# EAGLE design Schaltplan_Ampel (EAGLE 9.6.2)
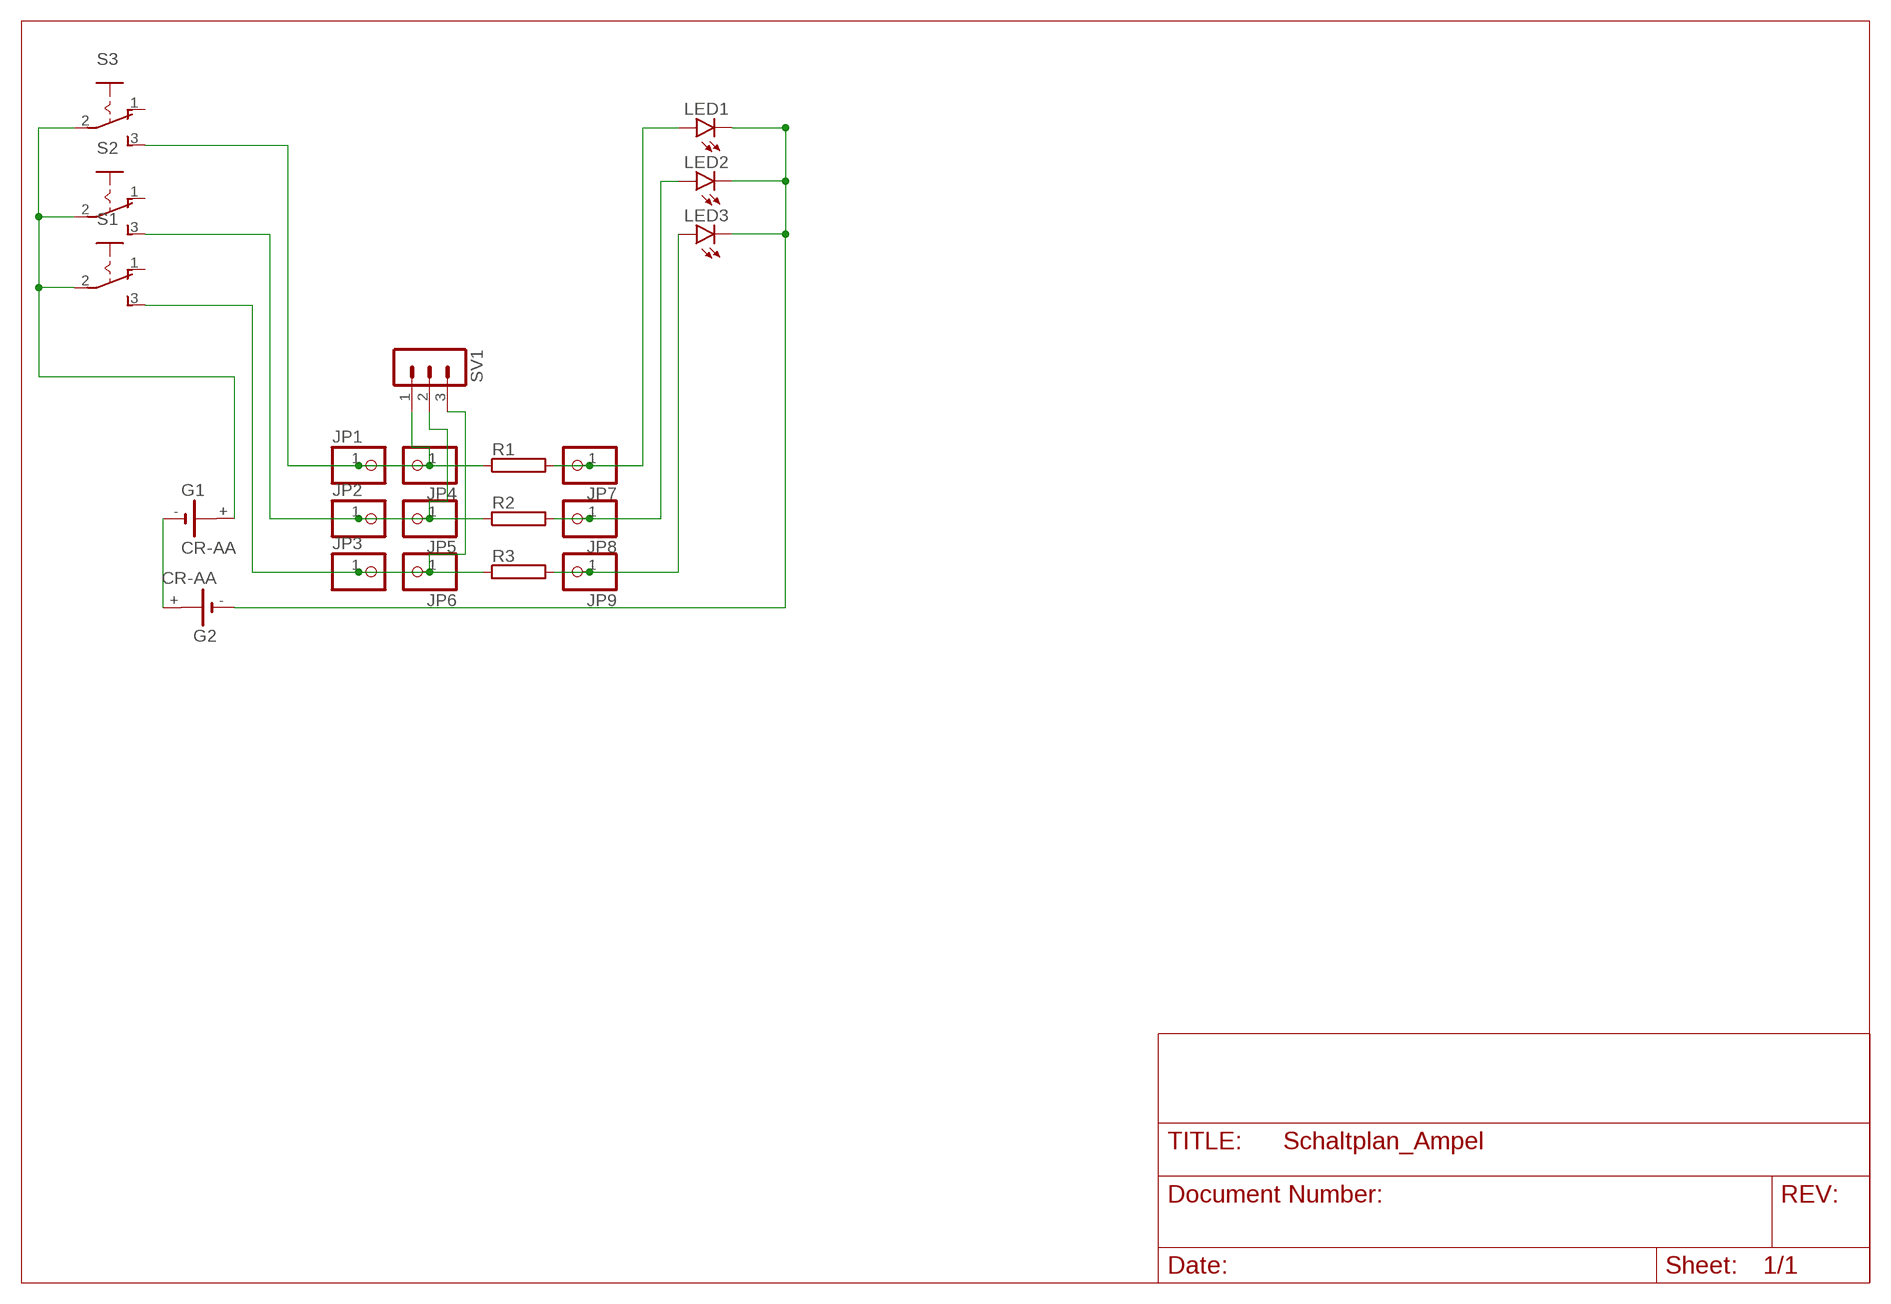
[diagram p0: schematic, sheet 1]

## Parts
G1  CR-AA  [CRAA]
G2  CR-AA  [CRAA]
JP1  PINHD-1X1  [1X01]
JP2  PINHD-1X1  [1X01]
JP3  PINHD-1X1  [1X01]
JP4  PINHD-1X1  [1X01]
JP5  PINHD-1X1  [1X01]
JP6  PINHD-1X1  [1X01]
JP7  PINHD-1X1  [1X01]
JP8  PINHD-1X1  [1X01]
JP9  PINHD-1X1  [1X01]
LED1  LED3MM  [LED3MM]
LED2  LED3MM  [LED3MM]
LED3  LED3MM  [LED3MM]
R1  RCA0002  [CA0002]
R2  RCA0002  [CA0002]
R3  RCA0002  [CA0002]
S1  255SB  [255SB]
S2  255SB  [255SB]
S3  255SB  [255SB]
SV1  MA03-1  [MA03-1]

## Nets
N$1: G1.- G2.+
N$2: G1.+ S1.2(P) S2.2(P) S3.2(P)
N$3: G2.- LED1.K(C) LED2.K(C) LED3.K(C)
N$4: JP3.1 JP6.1 R3.1 S1.3(S) SV1.3
N$5: JP2.1 JP5.1 R2.1 S2.3(S) SV1.2
N$6: JP1.1 JP4.1 R1.1 S3.3(S) SV1.1
N$7: JP7.1 LED1.A R1.2
N$8: JP8.1 LED2.A R2.2
N$9: JP9.1 LED3.A R3.2
Unconnected: G1.+@1(+) G2.+@1(+) S1.1(O) S2.1(O) S3.1(O)

## Library data of the parts
G1 G2 = battery:CR-AA: LI BATTERY Varta CRAA-SLF
JP1-JP9 = pinhead:PINHD-1X1: PIN HEADER
LED1-LED3 = led:LED: LED OSRAM: - CHIPLED LG R971, LG N971, LY N971, LG Q971, LY Q971, LO R971, LY R971 LH N974, LH R974 LS Q976, LO Q976, LY Q976 LO Q996 - Hyper CHIPLED LW Q18S LB Q993, LB Q99A, LB R99A - SideLED LS A670, LO A670, LY A670, LG A670, LP A670 LB A673, LV A673, LT A673, LW A673 LH A674 LY A675 LS A676, LA A676, LO A676, LY A676, LW A676 LS A679, LY A679, LG A679 - Hyper Micro SIDELED® LS Y876, LA Y876, LO Y876, LY Y876 LT Y87S - SmartLED LW L88C, LW L88S LB L89C, LB L89S, LG L890 LS L89K, LO L89K, LY L89K LS L896, LA L896, LO L896, LY L896 - TOPLED LS T670, LO T670, LY T670, LG T670, LP T670 LSG T670, LSP T670, LSY T670, LOP T670, LYG T670 LG T671, LOG T671, LSG T671 LB T673, LV T673, LT T673, LW T673 LH T674 LS T676, LA T676, LO T676, LY T676, LB T676, LH T676, LSB T676, LW T676 LB T67C, LV T67C, LT T67C, LS T67K, LO T67K, LY T67K, LW E67C LS E67B, LA E67B, LO E67B, LY E67B, LB E67C, LV E67C, LT E67C LW T67C LS T679, LY T679, LG T679 LS T770, LO T770, LY T770, LG T770, LP T770 LB T773, LV T773, LT T773, LW T773 LH T774 LS E675, LA E675, LY E675, LS T675 LS T776, LA T776, LO T776, LY T776, LB T776 LHGB T686 LT T68C, LB T68C - Hyper Mini TOPLED® LB M676 - Mini TOPLED Santana® LG M470 LS M47K, LO M47K, LY M47K Source: http://www.osram.convergy.de LUXEON: - LUMILED® LXK2-PW12-R00, LXK2-PW12-S00, LXK2-PW14-U00, LXK2-PW14-V00 LXK2-PM12-R00, LXK2-PM12-S00, LXK2-PM14-U00 LXK2-PE12-Q00, LXK2-PE12-R00, LXK2-PE12-S00, LXK2-PE14-T00, LXK2-PE14-U00 LXK2-PB12-K00, LXK2-PB12-L00, LXK2-PB12-M00, LXK2-PB14-N00, LXK2-PB14-P00, LXK2-PB14-Q00 LXK2-PR12-L00, LXK2-PR12-M00, LXK2-PR14-Q00, LXK2-PR14-R00 LXK2-PD12-Q00, LXK2-PD12-R00, LXK2-PD12-S00 LXK2-PH12-R00, LXK2-PH12-S00 LXK2-PL12-P00, LXK2-PL12-Q00, LXK2-PL12-R00 Source: www.luxeon.com KINGBRIGHT: KA-3528ASYC Source: www.kingbright.com
R1-R3 = resistor-power:R: Power Resitor; OC_FARNELL: unknown; OC_NEWARK: unknown
S1-S3 = switch:255SB: SLIDING SWITCH Distributor Buerklin, 11G810
SV1 = con-lstb:MA03-1: PIN HEADER; OC_FARNELL: unknown; OC_NEWARK: unknown

## Board
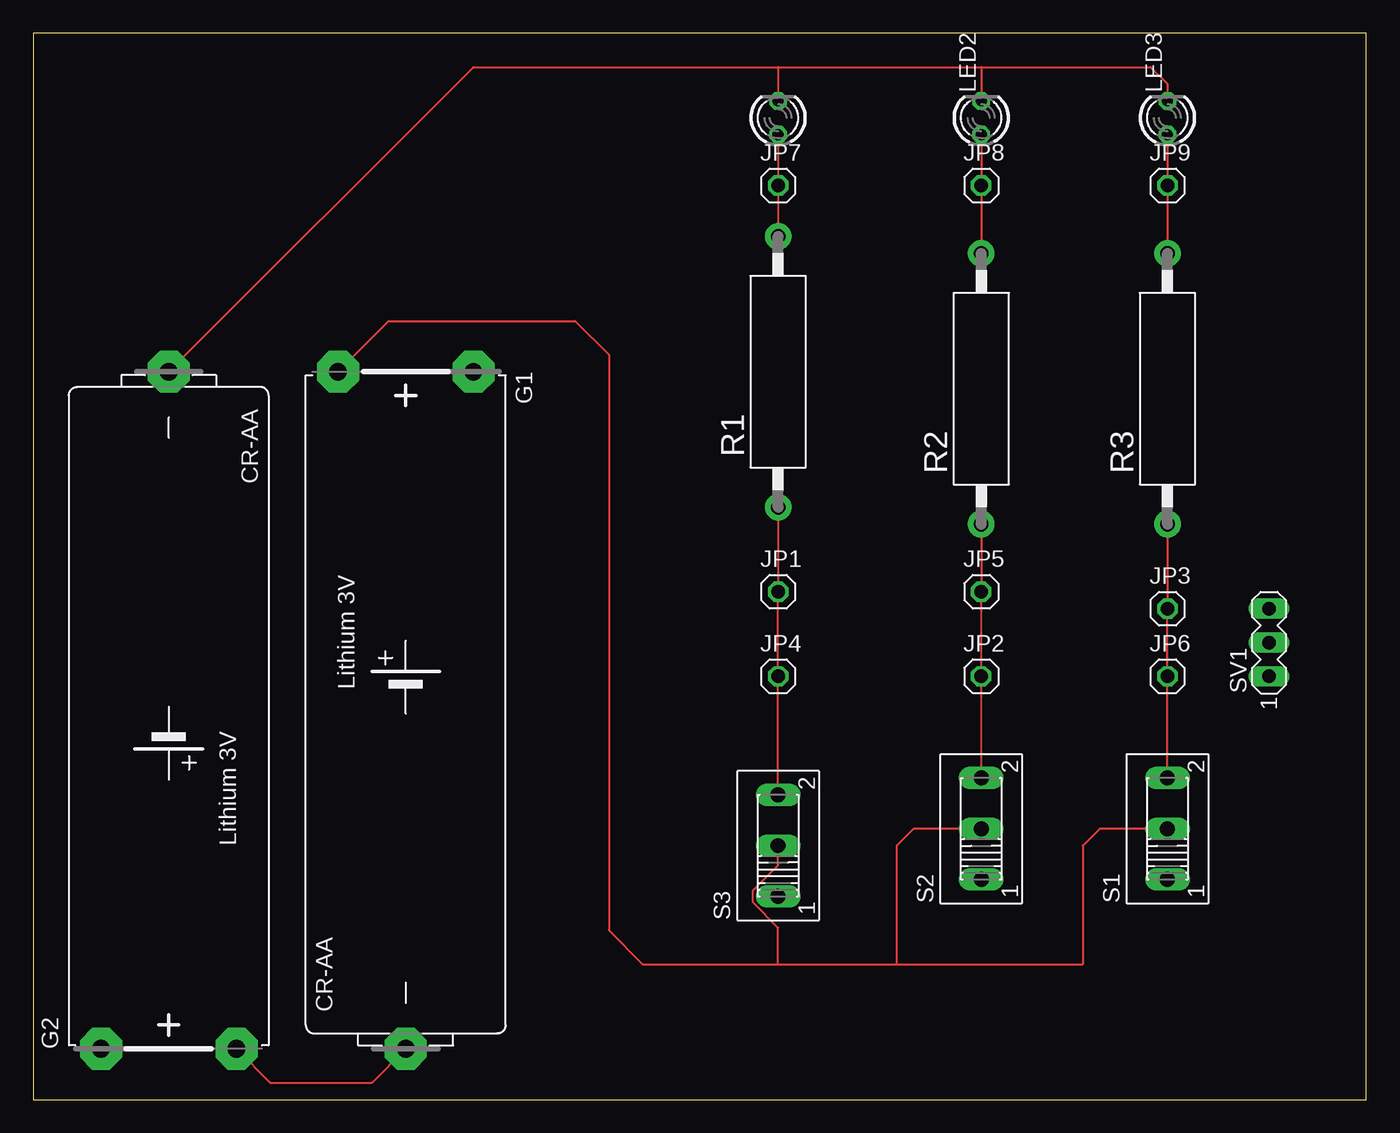
[diagram p1: board, top side]
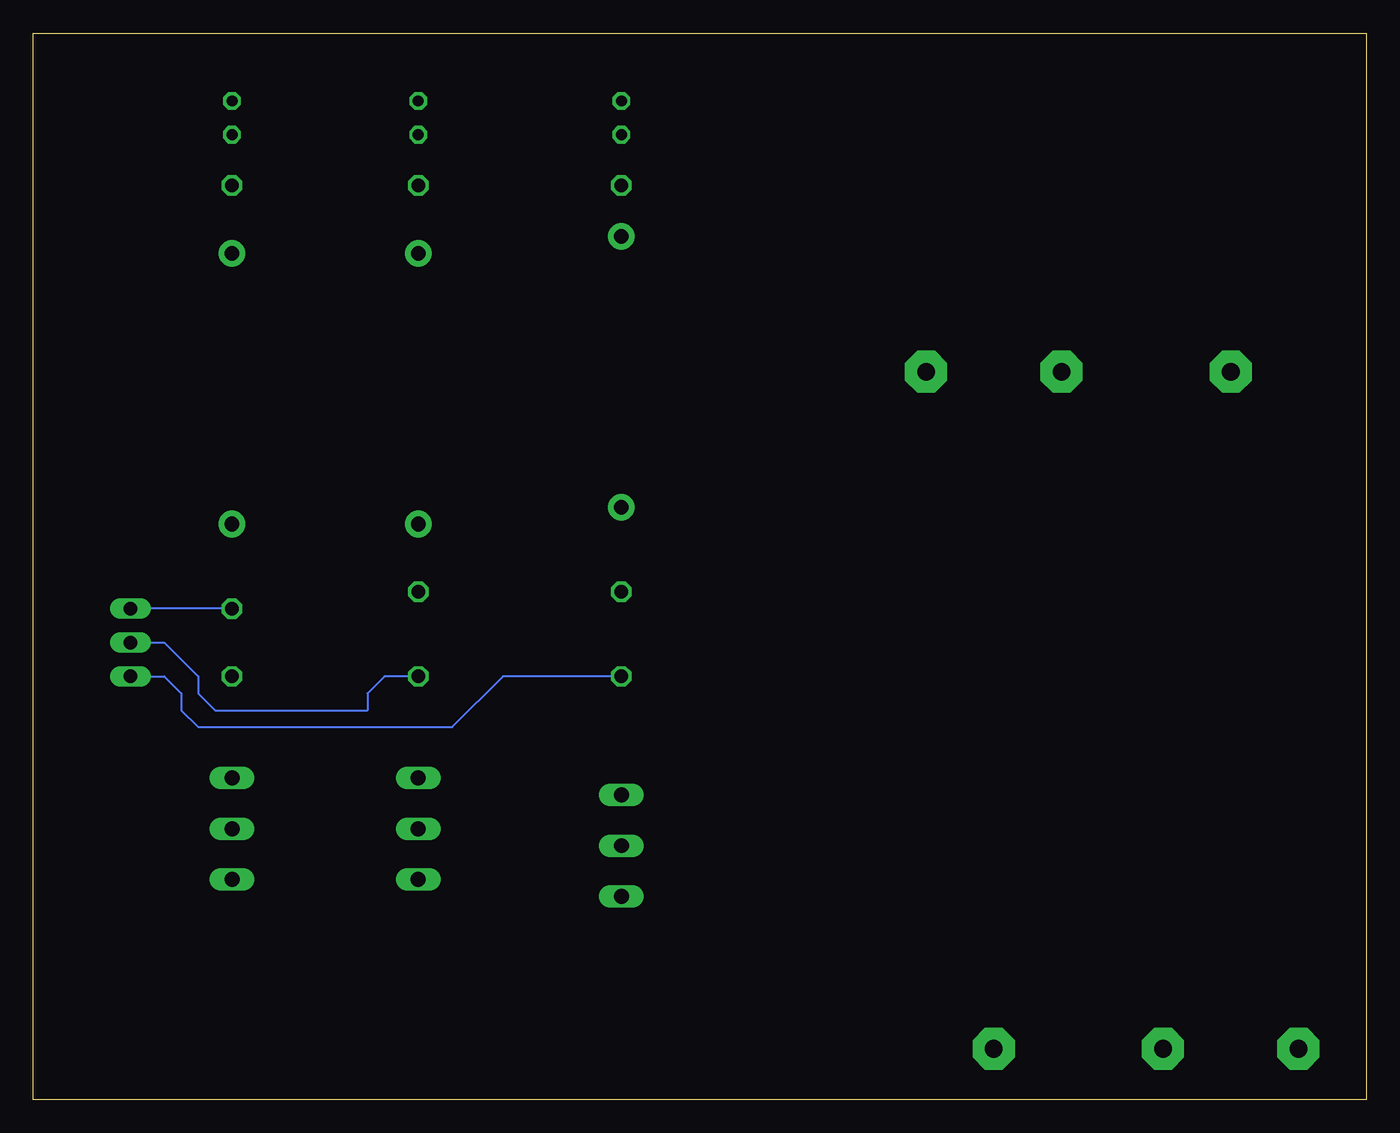
[diagram p2: board, bottom side, seen from below]

Size 100 x 80 mm. Coordinates in mm from the lower left corner, seen from the top.
Outline: 0,0 100,0 100,80 0,80 0,0
Copper layers (1*16): Top 0.035mm / dielectric 1.5mm / Bottom 0.035mm
Design rules "default": minimum track width 6mil, minimum drill 0.35mm, track to track 6mil, track to pad 6mil, pad to pad 6mil, via to via 6mil, smd to smd 6mil, copper to edge 40mil, drill to drill 6mil, minimum pad ring 10mil, minimum via ring 8mil, stop-mask expansion 4mil, vias tented up to drill 0mil, thermal gap 10mil

### Footprints (pad centres in the part's own frame; a part is rotated, then mirrored left to right if it is on the bottom)
CRAA = drill 1.321 pad 3.15 octagon: + -25.4,-5.08; +@1 -25.4,5.08; - 25.4,0
1X01 = drill 1.016 octagon: 1 0,0
LED3MM = drill 0.813 octagon: A -1.27,0; K 1.27,0
CA0002 = drill 1.1 pad 2: 1 -10.16,0; 2 10.16,0
255SB = drill 1.118 long: 1 -3.81,0; 2 0,0; 3 3.81,0
MA03-1 = drill 1.016 long: 1 -2.54,0; 2 0,0; 3 2.54,0

### Placement (x,y rotation side)
G1  27.94,29.21 270 top
G2  10.16,29.21 90 top
JP1  55.88,38.1 0 top
JP2  71.12,31.75 0 top
JP3  85.09,36.83 0 top
JP4  55.88,31.75 0 top
JP5  71.12,38.1 0 top
JP6  85.09,31.75 0 top
JP7  55.88,68.58 0 top
JP8  71.12,68.58 0 top
JP9  85.09,68.58 0 top
LED1  55.88,73.66 90 top
LED2  71.12,73.66 90 top
LED3  85.09,73.66 90 top
R1  55.88,54.61 90 top
R2  71.12,53.34 90 top
R3  85.09,53.34 90 top
S1  85.09,20.32 90 top
S2  71.12,20.32 90 top
S3  55.88,19.05 90 top
SV1  92.71,34.29 90 top

### Tracks (layer width: path | path; a pad name or v marks a point on that pad's centre or on a via)
N$1
  Top 0.152: G2.+ 17.78,1.27 25.4,1.27 G1.-
N$2
  Top 0.152: G1.+ 26.67,58.42 40.64,58.42 43.18,55.88 43.18,12.7 45.72,10.16 55.88,10.16 | 55.88,10.16 55.88,12.89 53.98,14.8 53.98,15.68 55.88,17.59 S3.2 | 55.88,10.16 64.77,10.16 | 64.77,10.16 78.74,10.16 78.74,19.05 80.01,20.32 S1.2 | S2.2 66.04,20.32 64.77,19.05 64.77,10.16
N$3
  Top 0.152: G2.- 33.02,77.47 55.88,77.47 | 55.88,77.47 LED1.K | 55.88,77.47 71.12,77.47 | 71.12,77.47 LED2.K | 71.12,77.47 83.82,77.47 85.09,76.2 LED3.K
N$4
  Top 0.152: R3.1 JP3.1 JP6.1 S1.3
  Bottom 0.152: JP3.1 SV1.3
N$5
  Top 0.152: R2.1 JP5.1 JP2.1 S2.3
  Bottom 0.152: JP2.1 73.66,31.75 74.93,30.48 74.93,29.21 86.36,29.21 87.63,30.48 87.63,31.75 90.17,34.29 SV1.2
N$6
  Top 0.152: R1.1 JP1.1 JP4.1 S3.3
  Bottom 0.152: JP4.1 64.77,31.75 68.58,27.94 87.63,27.94 88.9,29.21 88.9,30.48 90.17,31.75 SV1.1
N$7
  Top 0.152: LED1.A JP7.1 R1.2
N$8
  Top 0.152: LED2.A JP8.1 R2.2
N$9
  Top 0.152: LED3.A JP9.1 R3.2